# EAGLE design irblueV.2 (EAGLE 6.5.0)
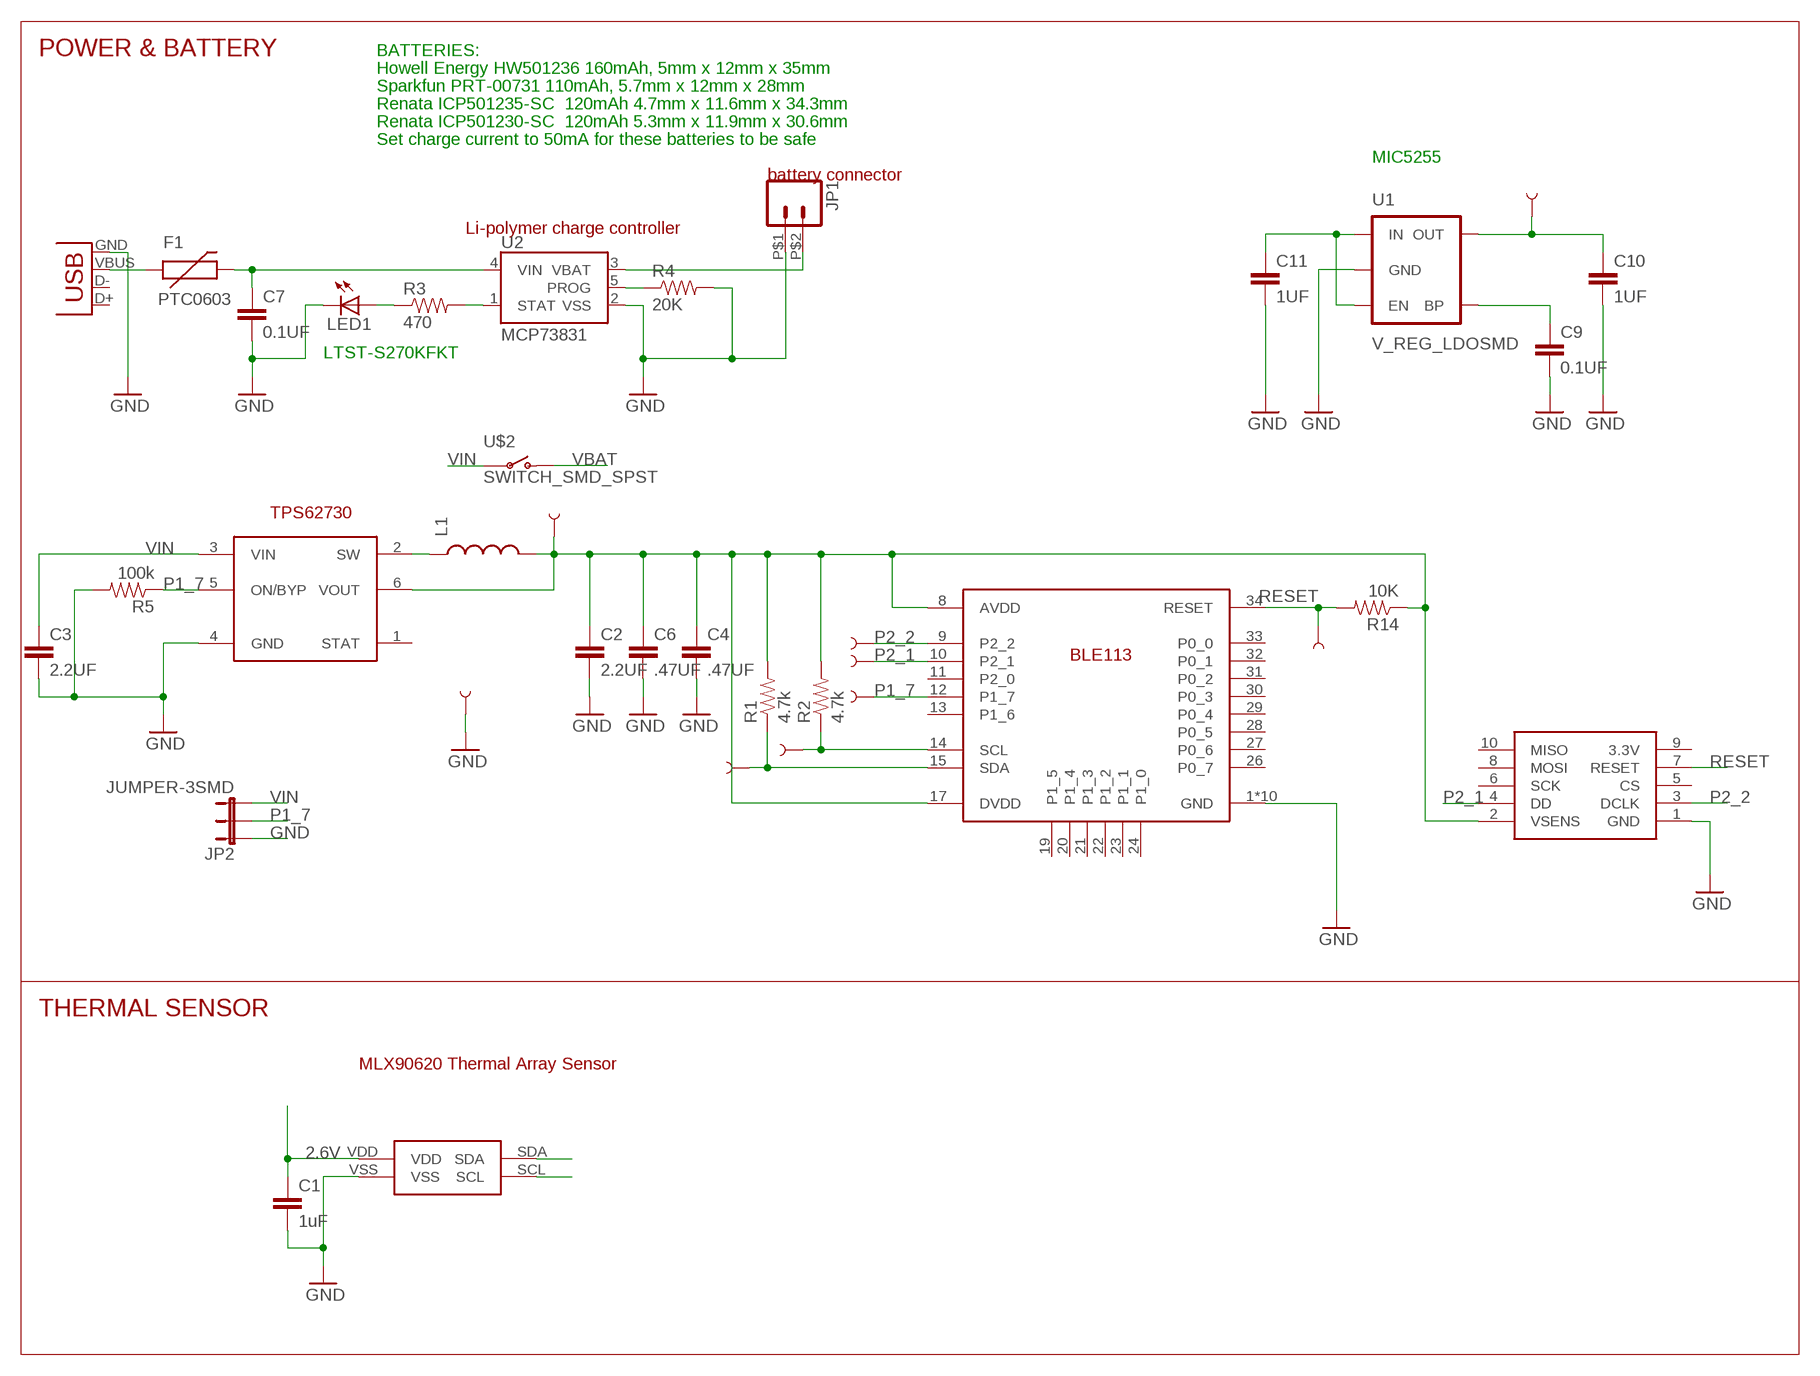
[diagram p0: schematic, sheet 1]

## Parts
C1  1uF  CAP0402-CAP  [0402-CAP]
C2  2.2UF  CAP0603-CAP  [0603-CAP]
C3  2.2UF  CAP0603-CAP  [0603-CAP]
C4  .47UF  CAP0402-CAP  [0402-CAP]
C6  .47UF  CAP0402-CAP  [0402-CAP]
C7  0.1UF  CAP0402-CAP  [0402-CAP]
C9  0.1UF  CAP0402-CAP  [0402-CAP]
C10  1UF  CAP0402-CAP  [0402-CAP]
C11  1UF  CAP0402-CAP  [0402-CAP]
F1  PTC0603  [0603]
JP1  M02WIRE  [1X02_1-WIRE]
JP2  JUMPER-3SMD  [SJ_3]
L1  INDUCTOR0805  [0805]
LED1  LED0603  [LED-0603]
R1  4.7k  RESISTOR0402-RES  [0402-RES]
R2  4.7k  RESISTOR0402-RES  [0402-RES]
R3  470  RESISTOR0402-RES  [0402-RES]
R4  20K  RESISTOR0402-RES  [0402-RES]
R5  100k  RESISTOR0402-RES  [0402-RES]
R14  10K  RESISTOR0402-RES  [0402-RES]
S1  MLX90620  [MLX90620]
TP1  TEST-POINT3X5  [PAD.03X.05]
TP2  TEST-POINT3X5  [PAD.03X.05]
TP3  TEST-POINT3X5  [PAD.03X.05]
TP4  TEST-POINT3X5  [PAD.03X.05]
TP5  TEST-POINT3X5  [PAD.03X.05]
TP6  TEST-POINT3X5  [PAD.03X.05]
TP7  TEST-POINT3X5  [PAD.03X.05]
TP8  TEST-POINT3X5  [PAD.03X.05]
TP9  TEST-POINT3X5  [PAD.03X.05]
U1  V_REG_LDOSMD  [SOT23-5]
U2  MCP73831  [SOT23-5]
U$1  TPS62730  [SON-6]
U$2  SWITCH_SMD_SPST  [SWITCH-SPDT-SMD]
U$5  BLE113  [BLE113]
U$8  TAG_CONNECT_CC_DEBUGGER  [TC2030-MCP-NL]
X1  USB-MICROB  [USB-MICROB]

## Nets
2.6V: C1.1 C10.1 S1.VDD TP9.P$1 U1.5(OUT)
GND: C1.2 C2.2 C3.2 C4.2 C6.2 C7.2 C9.2 C10.2 C11.2 JP1.P$1 JP2.1 LED1.C R4.2 R5.2 S1.VSS TP8.P$1 U1.2(GND) U2.2(VSS) U$1.4(GND) U$5.1(GND) U$5.2(GND) U$5.3(GND) U$5.4(GND) U$5.5(GND) U$5.6(GND) U$5.7(GND) U$5.18(GND) U$5.25(GND) U$5.36(GND) U$8.1(GND) X1.GND
N$3: F1.1 X1.VBUS
N$4: L1.1 U$1.2(SW)
N$5: R4.1 U2.5(PROG)
N$7: C7.1 F1.2 U2.4(VIN)
N$8: R3.2 U2.1(STAT)
N$9: LED1.A R3.1
N$13: C9.1 U1.4(BP)
P1_7: JP2.2 R5.1 TP3.P$1 U$1.5(ON/BYP) U$5.12(P1_7)
P2_1: TP2.P$1 U$5.10(P2_1) U$8.4(DD)
P2_2: TP1.P$1 U$5.9(P2_2) U$8.3(DCLK)
RESET: R14.2 TP4.P$1 U$5.34(RESET) U$8.7(RESET)
SCL: R2.1 S1.SCL TP5.P$1 U$5.14(SCL)
SDA: R1.1 S1.SDA TP6.P$1 U$5.15(SDA)
VBAT: JP1.P$2 U2.3(VBAT) U$2.1(O)
VIN: C3.1 C11.1 JP2.3 U1.1(IN) U1.3(EN) U$1.3(VIN) U$2.2(P)
VREG: C2.1 C4.1 C6.1 L1.2 R1.2 R2.2 R14.1 TP7.P$1 U$1.6(VOUT) U$5.8(AVDD) U$5.17(DVDD) U$8.2(VSENS)
Unconnected: U$1.1(STAT) U$5.11(P2_0) U$5.13(P1_6) U$5.19(P1_5) U$5.20(P1_4) U$5.21(P1_3) U$5.22(P1_2) U$5.23(P1_1) U$5.24(P1_0) U$5.26(P0_7) U$5.27(P0_6) U$5.28(P0_5) U$5.29(P0_4) U$5.30(P0_3) U$5.31(P0_2) U$5.32(P0_1) U$5.33(P0_0) U$8.5(CS) U$8.6(SCK) U$8.8(MOSI) U$8.9(3.3V) U$8.10(MISO) X1.D+ X1.D-

## Notes on the sheet
- POWER & BATTERY | BATTERIES:
- Howell Energy HW501236 160mAh, 5mm x 12mm x 35mm
- Sparkfun PRT-00731 110mAh, 5.7mm x 12mm x 28mm
- Renata ICP501235-SC  120mAh 4.7mm x 11.6mm x 34.3mm
- Renata ICP501230-SC  120mAh 5.3mm x 11.9mm x 30.6mm
- Set charge current to 50mA for these batteries to be safe
- MIC5255
- battery connector
- Li-polymer charge controller
- LTST-S270KFKT
- THERMAL SENSOR
- MLX90620 Thermal Array Sensor

## Library data of the parts
C1-C4 C6 = 10.ee_projects:CAP: Capacitor Standard 0603 ceramic capacitor, and 0.1" leaded capacitor.
C7 C9-C11 = 11.ee_projects:CAP: Capacitor Standard 0603 ceramic capacitor, and 0.1" leaded capacitor.
F1 = 10.SparkFun:PTC: Resettable Fuse PTC Resettable Fuse. Spark Fun Electronics SKU : COM-08357
JP1 = 10.ee_projects:M02: Header 2 Standard 2-pin 0.1" header. Use with straight break away headers (SKU : PRT-00116), right angle break away headers (PRT-00553), swiss pins (PRT-00743), machine pins (PRT-00117), and female headers (PRT-00115). Molex polarized connector foot print use with SKU : PRT-08233 with associated crimp pins and housings.
JP2 = 11.SparkFun:JUMPER-3
L1 = 10.SparkFun:INDUCTOR: Inductors Basic Inductor/Choke - 0603 and 1206. Footprints are not proven and vary greatly between part numbers.
LED1 = 10.SparkFun:LED: LEDs Standard schematic elements and footprints for 5mm, 3mm, 1206, and 0603 sized LEDs. 5mm - Spark Fun Electronics SKU : COM-00529 (and others)
R1 R2 R5 R14 = 10.ee_projects:RESISTOR: Resistor Basic schematic elements and footprints for 0603, 1206, and PTH resistors.
R3 R4 = 11.ee_projects:RESISTOR: Resistor Basic schematic elements and footprints for 0603, 1206, and PTH resistors.
S1 = MLX90620:MLX90620
TP1-TP9 = 10.SparkFun:TEST-POINT
U1 = 11.SparkFun:V_REG_LDO: Voltage Regulator LDO Standard 150mA LDO voltage regulator in SOT-23 layout. Micrel part MIC5205. BP (by-pass) pin is used to lower output noise with 470pF cap.
U2 = 10.SparkFun:MCP73831: Microchip's MCP73831 Miniature single cell, fully integrated Li-Ion, Li-polymer charge management controller http://ww1.microchip.com/downloads/en/DeviceDoc/21984a.pdf
U$1 = 10.ee_projects:TPS62730
U$2 = 12.KieranTimberlake:SWITCH_SMD_SPST; DIGIKEY_PN: 401-1999-1-ND; MFG: C&K Components; MFG_PN: JS102011SAQN
U$5 = 10.ee_projects:BLE113
U$8 = 11.ee_projects:TAG_CONNECT_CC_DEBUGGER
X1 = 10.SparkFun:USB: USB Connectors USB-B-PTH is fully proven SKU : PRT-00139 USB-miniB is fully proven SKU : PRT-00587 USB-A-PCB is untested. USB-A-H is throughly reviewed, but untested. Spark Fun Electronics SKU : PRT-00437 USB-B-SMT is throughly reviewed, but untested. Needs silkscreen touching up. USB-A-S has not been used/tested USB-MB-H has not been used/tested

## Net classes
0 default: width 0.152 mm, drill 0.33 mm, clearance 0.152 mm

## Board
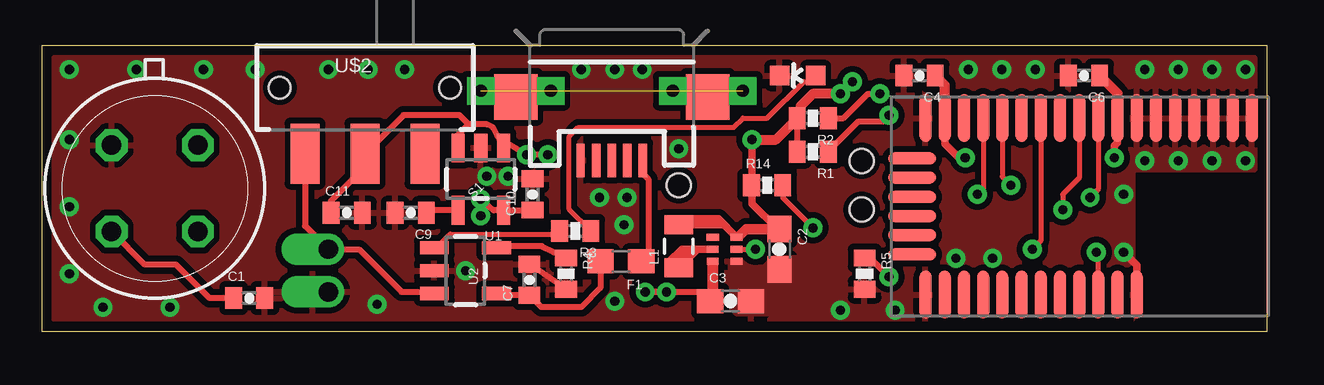
[diagram p1: board, top side]
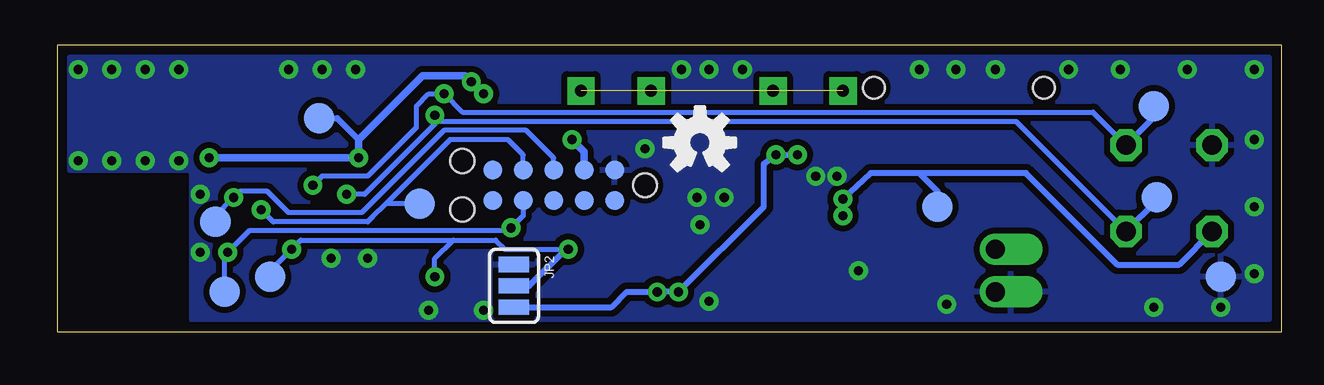
[diagram p2: board, bottom side, seen from below]

No outline drawn. Coordinates in mm, seen from the top.
Copper layers (1*16): Top 0.035mm / dielectric 1.5mm / Bottom 0.035mm
Design rules "default *": minimum track width 6mil, minimum drill 13mil, track to track 6mil, track to pad 6mil, pad to pad 6mil, via to via 6mil, smd to smd 6mil, copper to edge 10mil, drill to drill 8mil, minimum pad ring 10mil, minimum via ring 8mil, stop-mask expansion 4mil, vias tented up to drill 21mil, thermal gap 10mil
Milling: 4 lines

### Footprints (pad centres in the part's own frame; a part is rotated, then mirrored left to right if it is on the bottom)
0402-CAP = smd 0.7 x 0.9: 1 -0.65,0; 2 0.65,0
0603-CAP = smd 1.1 x 1: 1 -0.85,0; 2 0.85,0
0603 = smd 1.1 x 1: 1 -0.85,0; 2 0.85,0
1X02_1-WIRE = drill 0.8 pad 1.143 offset: P$1 0,1.778; P$2 0,0
SJ_3 = smd 0.635 x 1.27: 1 -0.889,0; 2 0,0; 3 0.889,0
0805 = smd 0.8 x 1.2: 1 -0.9,0; 2 0.9,0
LED-0603 = smd 0.8 x 0.8: A 0,-0.75; C 0,0.75
0402-RES = smd 0.7 x 0.9: 1 -0.65,0; 2 0.65,0
MLX90620 = drill 0.813 octagon: SCL -2.54,0; SDA 0,2.54; VDD 2.54,0; VSS 0,-2.54
PAD.03X.05 = smd 1.27 x 1.27: P$1 0,0
SOT23-5 = smd 0.55 x 1.2: 1 -0.95,-1.3; 2 0,-1.3; 3 0.95,-1.3; 4 0.95,1.3; 5 -0.95,1.3
SON-6 = smd 0.3 x 0.52: 1 -0.5,-0.495 | smd 0.3 x 0.49: 2 0,-0.495; 3 0.5,-0.495; 4 0.5,0.495; 5 0,0.495; 6 -0.5,0.495
SWITCH-SPDT-SMD = smd 1.2 x 2.5: 1 -2.5,-2.75; 2 0,-2.75; 3 2.5,-2.75 | hole 0.9: -3.55,0; 3.55,0
BLE113 = smd 2 x 0.5: 1 0,13.6; 2 0,12.8; 3 0,12; 4 0,11.2; 5 0,10.4; 6 0,9.6; 7 0,8.8; 8 0,8; 9 0,7.2; 10 0,6.4; 11 0,5.6; 12 0,4.8; 13 0,4; 14 0,3.2; 15 0,2.4; 16 0,1.6; 17 0,0.8; 18 0,0; 25 7.35,0; 26 7.35,0.8; 27 7.35,1.6; 28 7.35,2.4; 29 7.35,3.2; 30 7.35,4; 31 7.35,4.8; 32 7.35,5.6; 33 7.35,6.4; 34 7.35,7.2; 35 7.35,8; 36 7.35,8.8 | smd 0.5 x 2: 19 1.675,-0.55; 20 2.475,-0.55; 21 3.275,-0.55; 22 4.075,-0.55; 23 4.875,-0.55; 24 5.675,-0.55
TC2030-MCP-NL = smd 0.787 x 0.787: 1 1.27,-0.635; 2 2.54,-0.635; 3 3.81,-0.635; 4 5.08,-0.635; 5 6.35,-0.635; 6 6.35,0.635; 7 5.08,0.635; 8 3.81,0.635; 9 2.54,0.635; 10 1.27,0.635 | hole 1: 0,0; 7.62,-1.016; 7.62,1.016
USB-MICROB = smd 0.35 x 1.4: D+ 0,2.65; D- -0.65,2.65; GND 1.3,2.65; ID 0.65,2.65; VBUS -1.3,2.65 | smd 1.8 x 1.9: MT1 -4,0; MT2 4,0

### Placement (x,y rotation side)
C1  26.67,33.66 0 top
C2  48.77,35.69 270 top
C3  46.74,33.53 0 top
C4  54.61,42.93 180 top
C6  61.47,42.93 180 top
C7  38.35,34.42 90 top
C9  33.4,37.21 180 top
C10  38.48,37.97 90 top
C11  30.73,37.21 0 top
F1  42.16,35.18 180 top
JP1  29.97,35.69 180 top
JP2  50.04,34.16 270 bottom
L1  44.58,35.81 90 top
LED1  49.53,42.93 90 top
R1  50.16,39.75 180 top
R2  50.16,41.15 180 top
R3  40.26,36.45 180 top
R4  39.88,34.67 270 top
R5  52.32,34.67 270 top
R14  48.26,38.35 0 top
S1  22.73,38.23 225 top
TP1  62.48,36.83 0 bottom
TP2  53.98,37.59 0 bottom
TP3  60.2,34.54 0 bottom
TP4  62.1,33.91 0 bottom
TP5  23.37,41.66 0 bottom
TP6  23.24,37.85 0 bottom
TP7  58.17,41.15 0 bottom
TP8  20.57,34.54 0 bottom
TP9  32.38,37.47 0 bottom
U1  36.32,38.61 180 top
U2  35.69,34.8 270 top
U$1  46.48,35.69 270 top
U$2  31.5,42.42 0 top
U$4  [OSHW-LOGO-S]  42.29,40.13 0 bottom
U$5  54.86,41.15 270 top
U$8  44.58,38.35 180 bottom
X1  41.78,42.04 180 top

### Tracks (layer width: path | path; a pad name or v marks a point on that pad's centre or on a via)
2.6V  (via drill 0.38)
  Top 0.254: C1.1 25.02,33.66 23.62,35.05 22.32,35.05 S1.VDD | C10.1 38.47,37.31 U1.5 36.86,37.31 v36.32,37.78 36.32,37.21 | v36.32,37.08 36.32,37.21 | 36.32,37.21 36.58,37.47
  Bottom 0.254: S1.VDD 22.32,35.05 24.89,35.05 28.7,38.86 33.15,38.86 | 33.15,38.86 35.18,38.86 v36.32,37.78 v36.32,37.08 | TP9.P$1 32.38,38.1 33.15,38.86
GND  (via drill 0.38)
  Top 0.254: R4.2 39.53,34.27 C7.2
  Top 0.305: U$5.36 63.66,35.02 63.25,35.43
  other vias: 57.66,35.31 56.13,35.31 63.12,35.56 63.12,37.97 64.01,39.37 65.41,39.37 66.8,39.37 68.2,39.37 68.2,43.18 66.8,43.18 65.41,43.18 64.01,43.18 59.44,43.18 58.04,43.18 56.64,43.18 29.97,43.18 20.57,33.27 26.92,43.18 19.18,34.67 24.77,43.18 19.18,37.47 43.05,43.18 19.18,40.26 21.97,43.18 19.18,43.18 23.37,33.27 33.15,43.18 41.91,43.18 31.62,43.18 32,33.4 40.51,43.18 53.59,33.15 51.31,33.15 35.69,34.8 41.91,33.53 41.27,37.85 42.42,37.85 37.47,38.73 42.29,36.7 44.58,39.88 36.58,38.73
  pour Top (isolate 0.254): 18.54,32.77 18.54,43.69 68.58,43.69 68.58,38.99 63.5,38.99 63.5,32.77
  pour Bottom (isolate 0.254): 18.54,32.77 18.54,43.69 68.58,43.69 68.58,38.99 63.5,38.99 63.5,32.77
  pour Top (isolate 0.254, rank 2, no thermals): 46.74,35.18 46.74,33.27 46.99,33.02 49.02,33.02 49.66,33.66 49.66,35.18 49.53,35.31 48.51,35.31 48.13,34.92 47.37,34.92 47.12,35.18
N$1
  Top 0.305: 44.7,36.96 46.23,36.96 46.99,36.2 47.37,36.58 48.39,36.58
N$2
  Top 0.305: 45.34,35.69 45.09,35.69 44.96,35.69 | 44.96,35.69 44.32,35.05 | 44.96,35.69 44.7,35.69 44.2,35.18
N$3
  Top 0.254: X1.VBUS 43.08,38.83 43.31,38.61 43.31,35.47 F1.1
N$4
  Top 0.305: U$1.2 45.35,35.69 L1.1
N$5
  Top 0.254: R4.1 39.37,35.56 38.86,35.81 37.18,35.81 U2.5
N$6
  Top 0.203: 45.85,35.18 45.85,33.91
N$7
  Top 0.254: F1.2 41.31,34.08 40.51,33.27 38.85,33.27 C7.1 37.2,33.77 U2.4
N$8
  Top 0.203: U2.1 34.48,35.75 35.05,36.32 39.48,36.32 R3.2
N$9
  Top 0.203: LED1.A 50.03,42.67 49.78,42.67 48.26,41.15 47.24,41.15 46.86,40.77 40.39,40.77 40.01,40.39 40.01,37.35 R3.1
N$10
  Top 0.203: 46.1,35.18 46.1,33.91
N$12  (via drill 0.51 pad 1.14)  (3 unrouted)
  other vias: 36.32,42.29 39.24,42.29 44.32,42.29 47.24,42.29
N$13
  Top 0.254: U1.4 34.15,37.31 C9.1
P1_7  (via drill 0.38)
  Top 0.203: U$5.12 59.66,36.04 v59.31,35.69 | U$1.5 v47.78,35.69
  Top 0.254: R5.1 52.56,35.32 v53.34,34.54
  Bottom 0.203: 52.58,36.07 58.93,36.07 v59.31,35.69 60.2,34.8 TP3.P$1 | 52.58,36.07 50.8,36.07 50.42,35.69 v47.78,35.69 | v53.34,34.54 53.34,35.31 52.58,36.07
  Bottom 0.254: JP2.2 49.4,34.16 47.88,35.69 v47.78,35.69
P2_1  (via drill 0.38)
  Top 0.203: U$5.10 61.26,38.66 60.58,37.97 v60.58,37.34
  Bottom 0.203: U$8.4 49.66,39.62 50.29,40.26 52.7,40.26 55.37,37.59 | v60.58,37.34 60.07,36.83 56.13,36.83 55.94,37.02 55.37,37.59 | TP2.P$1 55.37,37.59
P2_2  (via drill 0.38)
  Top 0.203: U$5.9 62.06,38.19 v61.72,37.85
  Bottom 0.203: U$8.3 48.39,39.5 49.53,40.64 52.96,40.64 56.39,37.21 59.44,37.21 60.33,38.1 61.47,38.1 v61.72,37.85 62.48,37.08 TP1.P$1
RESET  (via drill 0.38)
  Top 0.203: U$5.34 62.06,35.47 v61.98,35.56 | R14.2 48.91,37.83 v50.16,36.58
  Bottom 0.203: U$8.7 49.66,37.08 v50.16,36.58 50.29,36.45 61.09,36.45 v61.98,35.56 62.1,35.43 TP4.P$1
SCL  (via drill 0.38)
  Top 0.203: U$5.14 58.06,38.71 v58.42,38.35
  Top 0.254: R2.1 51.44,41.15 52.45,42.16 v52.96,42.16
  Bottom 0.203: S1.SCL 25.91,41.4 52.2,41.4 v52.96,42.16 53.59,42.16 54.1,41.66 54.1,40.77 56.13,38.73 58.04,38.73 v58.42,38.35
  Bottom 0.254: TP5.P$1 23.37,41.18 S1.SCL
SDA  (via drill 0.38)
  Top 0.203: U$5.15 57.26,38.21 v57.02,37.97
  Top 0.254: R1.1 50.81,39.77 52.07,41.02 53.09,41.02 v53.34,41.27
  Bottom 0.203: S1.SDA 29.12,41.02 53.09,41.02 v53.34,41.27 53.34,40.89 56.26,37.97 v57.02,37.97
  Bottom 0.254: TP6.P$1 23.24,37.72 S1.SDA
VBAT
  Top 0.254: U2.3 33.69,33.91 33.02,33.91 31.24,35.69 JP1.P$2 29,36.66 U$2.1
VIN  (via drill 0.38)
  Top 0.254: v44.07,33.91 v43.18,33.91 45.51,33.91 C3.1 | 31.5,39.12 U$2.2 33.1,41.27 35.43,41.27 35.81,40.89 | 31.5,39.12 31.5,38.62 | C11.1 30.08,37.7 31.5,39.12 | U1.1 37.01,40.41 | 37.01,40.41 36.83,40.77 36.58,40.89 35.81,40.89 | 35.81,40.89 35.43,40.51 | 35.43,40.51 35.43,39.97 U1.3 35.37,40.45 35.43,40.51 | v39.12,39.62 v38.23,39.62 37.16,40.26 37.01,40.41
  Top 0.305: U$1.3 45.99,33.63 C3.1
  Bottom 0.254: v38.23,39.62 v39.12,39.62 39.62,39.24 39.62,37.47 v43.18,33.91 v44.07,33.91 45.34,33.91 45.97,33.27 JP2.3
VREG  (via drill 0.38)
  Top 0.254: R1.2 R2.2
  Top 0.305: U$5.17 55.66,40.09 56.26,39.5 v56.52,39.5 | v62.74,39.5 62.74,40.01 62.87,40.13 U$5.8 | v51.82,42.67 v51.31,42.16 | v47.62,40.26 47.62,38.37 R14.1 47.62,38.34 47.62,37.59 48.68,36.54 C2.1 48.68,36.45 47.37,36.45 47.11,36.19 U$1.6 46.45,36.71 L1.2
  Top 0.406: U$5.17 55.66,42.52 C4.1 | U$5.8 62.86,42.18 C6.1 | v51.31,42.16 50.16,42.16 49.66,41.66 49.66,41.29 R2.2 48.63,40.26 v47.62,40.26
  Bottom 0.254: TP7.P$1 57.4,41.15 56.52,40.26
  Bottom 0.305: v62.74,39.5 v56.52,39.5 56.52,40.26 53.85,42.93 52.07,42.93 v51.82,42.67 v51.31,42.16 | U$8.2 47.12,39.75 v47.62,40.26